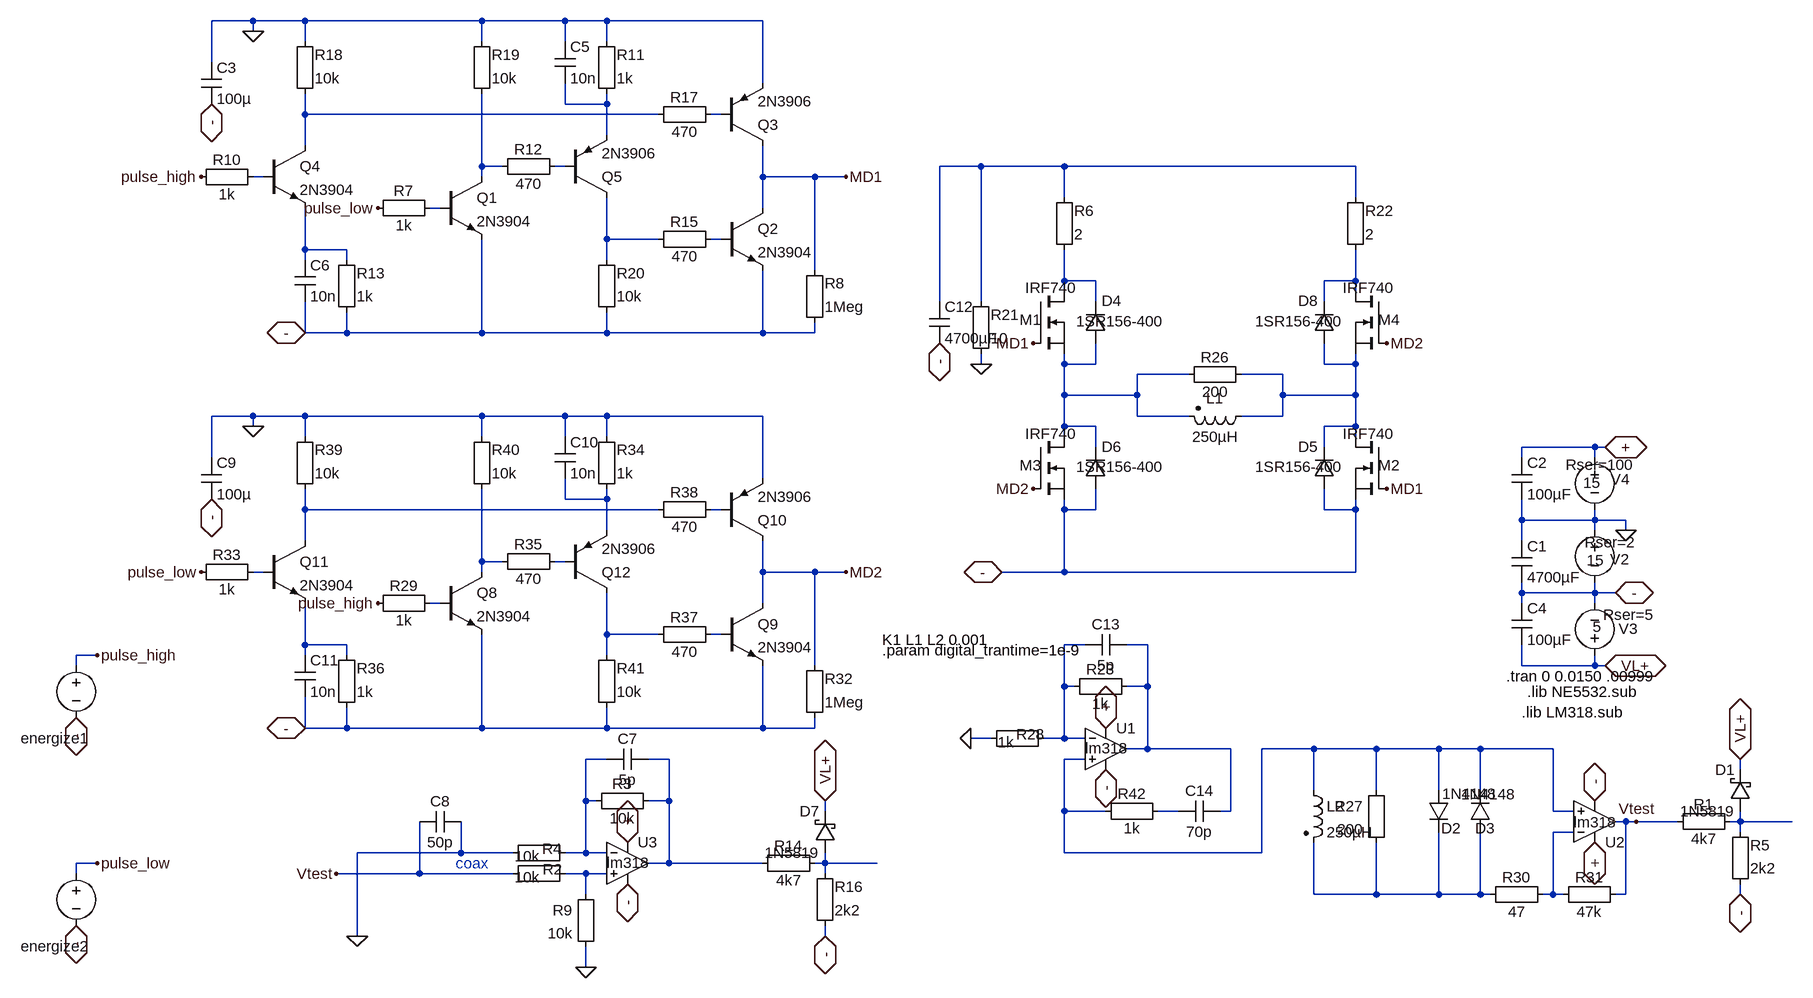
[diagram p0: schematic metal_low_power_fast_switch_ZVT_5.asc]
metal_low_power_fast_switch_ZVT_5.asc, the LTspice schematic file:
Version 4
SHEET 1 6068 1612
WIRE 96 -3040 32 -3040
WIRE 176 -3040 96 -3040
WIRE 448 -3040 176 -3040
WIRE 576 -3040 448 -3040
WIRE 640 -3040 576 -3040
WIRE 880 -3040 640 -3040
WIRE 96 -3024 96 -3040
WIRE 176 -3008 176 -3040
WIRE 448 -3008 448 -3040
WIRE 576 -3008 576 -3040
WIRE 640 -3008 640 -3040
WIRE 32 -2976 32 -3040
WIRE 880 -2944 880 -3040
WIRE 576 -2912 576 -2944
WIRE 640 -2912 640 -2928
WIRE 640 -2912 576 -2912
WIRE 176 -2896 176 -2928
WIRE 720 -2896 176 -2896
WIRE 816 -2896 800 -2896
WIRE 640 -2864 640 -2912
WIRE 176 -2848 176 -2896
WIRE 448 -2816 448 -2928
WIRE 480 -2816 448 -2816
WIRE 576 -2816 560 -2816
WIRE 1216 -2816 1152 -2816
WIRE 1344 -2816 1216 -2816
WIRE 1792 -2816 1344 -2816
WIRE 112 -2800 96 -2800
WIRE 448 -2800 448 -2816
WIRE 880 -2800 880 -2848
WIRE 960 -2800 880 -2800
WIRE 1008 -2800 960 -2800
WIRE 1344 -2768 1344 -2816
WIRE 1792 -2768 1792 -2816
WIRE 384 -2752 368 -2752
WIRE 880 -2752 880 -2800
WIRE 640 -2704 640 -2768
WIRE 720 -2704 640 -2704
WIRE 816 -2704 800 -2704
WIRE 176 -2688 176 -2752
WIRE 240 -2688 176 -2688
WIRE 176 -2672 176 -2688
WIRE 240 -2672 240 -2688
WIRE 640 -2672 640 -2704
WIRE 960 -2656 960 -2800
WIRE 1344 -2640 1344 -2688
WIRE 1392 -2640 1344 -2640
WIRE 1792 -2640 1792 -2688
WIRE 1792 -2640 1744 -2640
WIRE 1344 -2624 1344 -2640
WIRE 1792 -2624 1792 -2640
WIRE 1152 -2608 1152 -2816
WIRE 1216 -2608 1216 -2816
WIRE 1392 -2608 1392 -2640
WIRE 1744 -2608 1744 -2640
WIRE 176 -2560 176 -2608
WIRE 240 -2560 240 -2592
WIRE 240 -2560 176 -2560
WIRE 448 -2560 448 -2704
WIRE 448 -2560 240 -2560
WIRE 640 -2560 640 -2592
WIRE 640 -2560 448 -2560
WIRE 880 -2560 880 -2656
WIRE 880 -2560 640 -2560
WIRE 960 -2560 960 -2576
WIRE 960 -2560 880 -2560
WIRE 1216 -2512 1216 -2528
WIRE 1344 -2512 1344 -2528
WIRE 1392 -2512 1392 -2544
WIRE 1392 -2512 1344 -2512
WIRE 1744 -2512 1744 -2544
WIRE 1792 -2512 1792 -2528
WIRE 1792 -2512 1744 -2512
WIRE 1536 -2496 1456 -2496
WIRE 1680 -2496 1616 -2496
WIRE 1344 -2464 1344 -2512
WIRE 1456 -2464 1456 -2496
WIRE 1456 -2464 1344 -2464
WIRE 1680 -2464 1680 -2496
WIRE 1792 -2464 1792 -2512
WIRE 1792 -2464 1680 -2464
WIRE 96 -2432 32 -2432
WIRE 176 -2432 96 -2432
WIRE 448 -2432 176 -2432
WIRE 576 -2432 448 -2432
WIRE 640 -2432 576 -2432
WIRE 880 -2432 640 -2432
WIRE 1456 -2432 1456 -2464
WIRE 1536 -2432 1456 -2432
WIRE 1680 -2432 1680 -2464
WIRE 1680 -2432 1616 -2432
WIRE 96 -2416 96 -2432
WIRE 1344 -2416 1344 -2464
WIRE 1392 -2416 1344 -2416
WIRE 1792 -2416 1792 -2464
WIRE 1792 -2416 1744 -2416
WIRE 176 -2400 176 -2432
WIRE 448 -2400 448 -2432
WIRE 576 -2400 576 -2432
WIRE 640 -2400 640 -2432
WIRE 1344 -2400 1344 -2416
WIRE 1792 -2400 1792 -2416
WIRE 1392 -2384 1392 -2416
WIRE 1744 -2384 1744 -2416
WIRE 2160 -2384 2048 -2384
WIRE 2176 -2384 2160 -2384
WIRE 32 -2368 32 -2432
WIRE 2048 -2368 2048 -2384
WIRE 2160 -2368 2160 -2384
WIRE 880 -2336 880 -2432
WIRE 576 -2304 576 -2336
WIRE 640 -2304 640 -2320
WIRE 640 -2304 576 -2304
WIRE 176 -2288 176 -2320
WIRE 720 -2288 176 -2288
WIRE 816 -2288 800 -2288
WIRE 1344 -2288 1344 -2304
WIRE 1392 -2288 1392 -2320
WIRE 1392 -2288 1344 -2288
WIRE 1744 -2288 1744 -2320
WIRE 1792 -2288 1792 -2304
WIRE 1792 -2288 1744 -2288
WIRE 2048 -2272 2048 -2304
WIRE 2160 -2272 2160 -2288
WIRE 2160 -2272 2048 -2272
WIRE 2208 -2272 2160 -2272
WIRE 640 -2256 640 -2304
WIRE 2160 -2256 2160 -2272
WIRE 2208 -2256 2208 -2272
WIRE 176 -2240 176 -2288
WIRE 2048 -2240 2048 -2272
WIRE 448 -2208 448 -2320
WIRE 480 -2208 448 -2208
WIRE 576 -2208 560 -2208
WIRE 112 -2192 96 -2192
WIRE 448 -2192 448 -2208
WIRE 880 -2192 880 -2240
WIRE 960 -2192 880 -2192
WIRE 1008 -2192 960 -2192
WIRE 1344 -2192 1344 -2288
WIRE 1344 -2192 1248 -2192
WIRE 1792 -2192 1792 -2288
WIRE 1792 -2192 1344 -2192
WIRE 2048 -2160 2048 -2176
WIRE 2160 -2160 2160 -2176
WIRE 2160 -2160 2048 -2160
WIRE 2192 -2160 2160 -2160
WIRE 384 -2144 368 -2144
WIRE 880 -2144 880 -2192
WIRE 2048 -2144 2048 -2160
WIRE 2160 -2144 2160 -2160
WIRE 640 -2096 640 -2160
WIRE 720 -2096 640 -2096
WIRE 816 -2096 800 -2096
WIRE 176 -2080 176 -2144
WIRE 240 -2080 176 -2080
WIRE 1376 -2080 1344 -2080
WIRE 1472 -2080 1440 -2080
WIRE -144 -2064 -176 -2064
WIRE 176 -2064 176 -2080
WIRE 240 -2064 240 -2080
WIRE 640 -2064 640 -2096
WIRE -176 -2048 -176 -2064
WIRE 960 -2048 960 -2192
WIRE 2048 -2048 2048 -2080
WIRE 2160 -2048 2160 -2064
WIRE 2160 -2048 2048 -2048
WIRE 2176 -2048 2160 -2048
WIRE 1344 -2016 1344 -2080
WIRE 1360 -2016 1344 -2016
WIRE 1472 -2016 1472 -2080
WIRE 1472 -2016 1440 -2016
WIRE 176 -1952 176 -2000
WIRE 240 -1952 240 -1984
WIRE 240 -1952 176 -1952
WIRE 448 -1952 448 -2096
WIRE 448 -1952 240 -1952
WIRE 640 -1952 640 -1984
WIRE 640 -1952 448 -1952
WIRE 880 -1952 880 -2048
WIRE 880 -1952 640 -1952
WIRE 960 -1952 960 -1968
WIRE 960 -1952 880 -1952
WIRE 1232 -1936 1200 -1936
WIRE 1344 -1936 1344 -2016
WIRE 1344 -1936 1312 -1936
WIRE 1376 -1936 1344 -1936
WIRE 1472 -1920 1472 -2016
WIRE 1472 -1920 1440 -1920
WIRE 1600 -1920 1472 -1920
WIRE 1728 -1920 1648 -1920
WIRE 1824 -1920 1728 -1920
WIRE 1920 -1920 1824 -1920
WIRE 1984 -1920 1920 -1920
WIRE 2096 -1920 1984 -1920
WIRE 640 -1904 608 -1904
WIRE 736 -1904 704 -1904
WIRE 1376 -1904 1344 -1904
WIRE 2384 -1888 2384 -1904
WIRE 1728 -1856 1728 -1920
WIRE 1824 -1856 1824 -1920
WIRE 1920 -1856 1920 -1920
WIRE 1984 -1856 1984 -1920
WIRE 608 -1840 608 -1904
WIRE 624 -1840 608 -1840
WIRE 736 -1840 736 -1904
WIRE 736 -1840 704 -1840
WIRE 976 -1824 976 -1840
WIRE 1344 -1824 1344 -1904
WIRE 1408 -1824 1344 -1824
WIRE 1520 -1824 1488 -1824
WIRE 1600 -1824 1600 -1920
WIRE 1600 -1824 1584 -1824
WIRE 2096 -1824 2096 -1920
WIRE 2128 -1824 2096 -1824
WIRE 2208 -1808 2192 -1808
WIRE 2224 -1808 2208 -1808
WIRE 2288 -1808 2224 -1808
WIRE 2384 -1808 2384 -1824
WIRE 2384 -1808 2368 -1808
WIRE 2464 -1808 2384 -1808
WIRE 2128 -1792 2096 -1792
WIRE 2384 -1792 2384 -1808
WIRE 416 -1760 416 -1808
WIRE 416 -1760 256 -1760
WIRE 496 -1760 416 -1760
WIRE 608 -1760 608 -1840
WIRE 608 -1760 576 -1760
WIRE 640 -1760 608 -1760
WIRE 1344 -1760 1344 -1824
WIRE 1648 -1760 1648 -1920
WIRE 1648 -1760 1344 -1760
WIRE -144 -1744 -176 -1744
WIRE 736 -1744 736 -1840
WIRE 736 -1744 704 -1744
WIRE 880 -1744 736 -1744
WIRE 976 -1744 976 -1760
WIRE 976 -1744 960 -1744
WIRE 1056 -1744 976 -1744
WIRE -176 -1728 -176 -1744
WIRE 352 -1728 352 -1808
WIRE 352 -1728 224 -1728
WIRE 496 -1728 352 -1728
WIRE 608 -1728 576 -1728
WIRE 640 -1728 608 -1728
WIRE 976 -1728 976 -1744
WIRE 608 -1696 608 -1728
WIRE 1728 -1696 1728 -1776
WIRE 1824 -1696 1824 -1776
WIRE 1824 -1696 1728 -1696
WIRE 1920 -1696 1920 -1792
WIRE 1920 -1696 1824 -1696
WIRE 1984 -1696 1984 -1792
WIRE 1984 -1696 1920 -1696
WIRE 2000 -1696 1984 -1696
WIRE 2096 -1696 2096 -1792
WIRE 2096 -1696 2080 -1696
WIRE 2112 -1696 2096 -1696
WIRE 2208 -1696 2208 -1808
WIRE 2208 -1696 2192 -1696
WIRE 2384 -1696 2384 -1712
WIRE 256 -1632 256 -1760
WIRE 976 -1632 976 -1648
WIRE 608 -1584 608 -1616
FLAG 2192 -2160 -
IOPIN 2192 -2160 BiDir
FLAG 2176 -2384 +
IOPIN 2176 -2384 BiDir
FLAG 2208 -2256 0
FLAG 2176 -2048 VL+
IOPIN 2176 -2048 BiDir
FLAG 976 -1632 -
IOPIN 976 -1632 BiDir
FLAG 976 -1840 VL+
IOPIN 976 -1840 BiDir
FLAG 672 -1776 +
IOPIN 672 -1776 BiDir
FLAG 672 -1712 -
IOPIN 672 -1712 BiDir
FLAG 224 -1728 Vtest
FLAG 608 -1584 0
FLAG 256 -1632 0
FLAG 32 -2304 -
IOPIN 32 -2304 BiDir
FLAG 96 -2416 0
FLAG 2160 -1776 +
IOPIN 2160 -1776 BiDir
FLAG 2160 -1840 -
IOPIN 2160 -1840 BiDir
FLAG 2224 -1808 Vtest
FLAG 2384 -1696 -
IOPIN 2384 -1696 BiDir
FLAG 2384 -1904 VL+
IOPIN 2384 -1904 BiDir
FLAG -176 -1968 -
IOPIN -176 -1968 BiDir
FLAG -144 -2064 pulse_high
FLAG -176 -1648 -
IOPIN -176 -1648 BiDir
FLAG -144 -1744 pulse_low
FLAG 32 -2912 -
IOPIN 32 -2912 BiDir
FLAG 96 -3024 0
FLAG 1008 -2800 MD1
FLAG 1008 -2192 MD2
FLAG 1296 -2320 MD2
FLAG 1840 -2544 MD2
FLAG 1296 -2544 MD1
FLAG 1840 -2320 MD1
FLAG 1152 -2544 -
IOPIN 1152 -2544 BiDir
FLAG 1216 -2512 0
FLAG 1248 -2192 -
IOPIN 1248 -2192 BiDir
FLAG 176 -2560 -
IOPIN 176 -2560 BiDir
FLAG 176 -1952 -
IOPIN 176 -1952 BiDir
FLAG 288 -2144 pulse_high
FLAG 16 -2800 pulse_high
FLAG 16 -2192 pulse_low
FLAG 288 -2752 pulse_low
FLAG 1408 -1952 +
IOPIN 1408 -1952 BiDir
FLAG 1408 -1888 -
IOPIN 1408 -1888 BiDir
FLAG 1200 -1936 0
SYMBOL voltage 2160 -2272 M0
WINDOW 123 0 0 Left 2
WINDOW 39 -63 34 Left 2
WINDOW 0 -53 60 Left 2
WINDOW 3 -15 62 Left 2
SYMATTR SpiceLine Rser=2
SYMATTR InstName V2
SYMATTR Value 15
SYMBOL voltage 2160 -2384 M0
WINDOW 123 0 0 Left 2
WINDOW 39 -61 27 Left 2
WINDOW 0 -54 49 Left 2
WINDOW 3 -9 55 Left 2
SYMATTR SpiceLine Rser=100
SYMATTR InstName V4
SYMATTR Value 15
SYMBOL voltage 2160 -2048 M180
WINDOW 123 0 0 Left 2
WINDOW 39 13 78 Left 2
WINDOW 0 37 57 Left 2
WINDOW 3 -3 60 Left 2
SYMATTR SpiceLine Rser=5
SYMATTR InstName V3
SYMATTR Value 5
SYMBOL Misc\\EuropeanCap 2032 -2240 R0
SYMATTR InstName C1
SYMATTR Value 4700µF
SYMATTR SpiceLine V=400 Irms=1 Rser=.32 Lser=0
SYMBOL Misc\\EuropeanCap 2032 -2368 R0
SYMATTR InstName C2
SYMATTR Value 100µF
SYMATTR SpiceLine V=400 Irms=1 Rser=.32 Lser=0
SYMBOL Misc\\EuropeanCap 2032 -2144 R0
SYMATTR InstName C4
SYMATTR Value 100µF
SYMATTR SpiceLine V=400 Irms=1 Rser=.32 Lser=0
SYMBOL Misc\\EuropeanResistor 864 -1728 R270
WINDOW 0 27 56 VTop 2
WINDOW 3 5 56 VBottom 2
SYMATTR InstName R14
SYMATTR Value 4k7
SYMBOL Misc\\EuropeanResistor 960 -1632 M180
WINDOW 0 31 76 Left 2
WINDOW 3 31 40 Left 2
SYMATTR InstName R16
SYMATTR Value 2k2
SYMBOL schottky 992 -1760 R180
WINDOW 0 24 64 Left 2
WINDOW 3 24 0 Left 2
SYMATTR InstName D7
SYMATTR Value 1N5819
SYMATTR Description Diode
SYMATTR Type diode
SYMBOL Opamps\\opamp2 672 -1808 R0
WINDOW 3 -32 63 Left 2
SYMATTR Value lm318
SYMATTR InstName U3
SYMBOL Misc\\EuropeanResistor 608 -1856 M90
WINDOW 0 5 56 VBottom 2
WINDOW 3 27 56 VTop 2
SYMATTR InstName R3
SYMATTR Value 10k
SYMBOL Misc\\EuropeanCap 704 -1888 M270
WINDOW 0 32 32 VTop 2
WINDOW 3 0 32 VBottom 2
SYMATTR InstName C7
SYMATTR Value 5p
SYMATTR SpiceLine V=400 Irms=1 Rser=.32 Lser=0
SYMBOL Misc\\EuropeanCap 416 -1792 M270
WINDOW 0 32 32 VTop 2
WINDOW 3 0 32 VBottom 2
SYMATTR InstName C8
SYMATTR Value 50p
SYMATTR SpiceLine V=400 Irms=1 Rser=.32 Lser=0
SYMBOL Misc\\EuropeanResistor 480 -1744 M90
WINDOW 0 25 77 VBottom 2
WINDOW 3 6 38 VTop 2
SYMATTR InstName R2
SYMATTR Value 10k
SYMBOL Misc\\EuropeanResistor 624 -1712 M0
SYMATTR InstName R9
SYMATTR Value 10k
SYMBOL Misc\\EuropeanResistor 480 -1776 M90
WINDOW 0 25 76 VBottom 2
WINDOW 3 6 38 VTop 2
SYMATTR InstName R4
SYMATTR Value 10k
SYMBOL Misc\\EuropeanCap 16 -2368 R0
SYMATTR InstName C9
SYMATTR Value 100µ
SYMATTR SpiceLine V=400 Irms=1 Rser=.32 Lser=0
SYMBOL Misc\\EuropeanResistor 1520 -2512 M90
WINDOW 0 5 56 VBottom 2
WINDOW 3 27 56 VTop 2
SYMATTR InstName R26
SYMATTR Value 200
SYMBOL Misc\\EuropeanResistor 1840 -1872 M0
SYMATTR InstName R27
SYMATTR Value 200
SYMBOL diode 1904 -1856 R0
WINDOW 3 21 5 Left 2
WINDOW 0 20 58 Left 2
SYMATTR Value 1N4148
SYMATTR InstName D2
SYMBOL diode 2000 -1792 R180
WINDOW 0 -7 6 Left 2
WINDOW 3 -39 58 Left 2
SYMATTR InstName D3
SYMATTR Value 1N4148
SYMBOL nmos 1296 -2400 R0
WINDOW 0 -21 44 Left 2
WINDOW 3 -12 -5 Left 2
SYMATTR InstName M3
SYMATTR Value IRF740
SYMBOL npn3 384 -2192 R0
SYMATTR InstName Q8
SYMATTR Value 2N3904
SYMBOL Misc\\EuropeanResistor 272 -2160 M90
WINDOW 0 5 56 VBottom 2
WINDOW 3 27 56 VTop 2
SYMATTR InstName R29
SYMATTR Value 1k
SYMBOL Opamps\\opamp2 2160 -1744 M180
WINDOW 3 -32 63 Left 2
SYMATTR Value lm318
SYMATTR InstName U2
SYMBOL Misc\\EuropeanResistor 1984 -1680 R270
WINDOW 0 27 56 VTop 2
WINDOW 3 5 56 VBottom 2
SYMATTR InstName R30
SYMATTR Value 47
SYMBOL Misc\\EuropeanResistor 2096 -1680 R270
WINDOW 0 27 56 VTop 2
WINDOW 3 5 56 VBottom 2
SYMATTR InstName R31
SYMATTR Value 47k
SYMBOL npn3 816 -2144 R0
SYMATTR InstName Q9
SYMATTR Value 2N3904
SYMBOL diode 1408 -2320 R180
WINDOW 0 -24 65 Left 2
WINDOW 3 -90 34 Left 2
SYMATTR InstName D6
SYMATTR Value 1SR156-400
SYMATTR Description Zener Diode
SYMATTR Type zener
SYMBOL pnp2 816 -2240 M180
SYMATTR InstName Q10
SYMATTR Value 2N3906
SYMBOL Misc\\EuropeanResistor 944 -1952 M180
WINDOW 0 31 76 Left 2
WINDOW 3 31 40 Left 2
SYMATTR InstName R32
SYMATTR Value 1Meg
SYMBOL voltage -176 -2064 M0
WINDOW 0 -21 128 Left 2
WINDOW 3 -134 119 Invisible 2
WINDOW 123 0 0 Left 2
SYMATTR InstName energize1
SYMATTR Value PULSE(0 4.8 .01 {digital_trantime} {digital_trantime} .002 .004 1000)
SYMATTR SpiceLine Rser=0
SYMBOL npn3 112 -2240 R0
SYMATTR InstName Q11
SYMATTR Value 2N3904
SYMBOL Misc\\EuropeanResistor 0 -2208 M90
WINDOW 0 5 56 VBottom 2
WINDOW 3 27 56 VTop 2
SYMATTR InstName R33
SYMATTR Value 1k
SYMBOL pnp2 576 -2160 M180
SYMATTR InstName Q12
SYMATTR Value 2N3906
SYMBOL Misc\\EuropeanResistor 624 -2304 M180
WINDOW 0 31 76 Left 2
WINDOW 3 31 40 Left 2
SYMATTR InstName R34
SYMATTR Value 1k
SYMBOL Misc\\EuropeanResistor 464 -2224 M90
WINDOW 0 5 56 VBottom 2
WINDOW 3 27 56 VTop 2
SYMATTR InstName R35
SYMATTR Value 470
SYMBOL Misc\\EuropeanCap 560 -2400 R0
SYMATTR InstName C10
SYMATTR Value 10n
SYMATTR SpiceLine V=400 Irms=1 Rser=.32 Lser=0
SYMBOL Misc\\EuropeanResistor 224 -1968 M180
WINDOW 0 31 76 Left 2
WINDOW 3 31 40 Left 2
SYMATTR InstName R36
SYMATTR Value 1k
SYMBOL Misc\\EuropeanCap 160 -2064 R0
SYMATTR InstName C11
SYMATTR Value 10n
SYMATTR SpiceLine V=400 Irms=1 Rser=.32 Lser=0
SYMBOL Misc\\EuropeanResistor 816 -2080 M270
WINDOW 0 27 56 VTop 2
WINDOW 3 5 56 VBottom 2
SYMATTR InstName R37
SYMATTR Value 470
SYMBOL Misc\\EuropeanResistor 704 -2304 M90
WINDOW 0 5 56 VBottom 2
WINDOW 3 27 56 VTop 2
SYMATTR InstName R38
SYMATTR Value 470
SYMBOL Misc\\EuropeanResistor 160 -2304 M180
WINDOW 0 31 76 Left 2
WINDOW 3 31 40 Left 2
SYMATTR InstName R39
SYMATTR Value 10k
SYMBOL Misc\\EuropeanResistor 432 -2304 M180
WINDOW 0 31 76 Left 2
WINDOW 3 31 40 Left 2
SYMATTR InstName R40
SYMATTR Value 10k
SYMBOL Misc\\EuropeanResistor 624 -1968 M180
WINDOW 0 31 76 Left 2
WINDOW 3 31 40 Left 2
SYMATTR InstName R41
SYMATTR Value 10k
SYMBOL ind2 1632 -2448 R90
WINDOW 0 4 56 VBottom 2
WINDOW 3 32 56 VTop 2
SYMATTR InstName L1
SYMATTR Value 250µH
SYMATTR SpiceLine Rser=.4 Cpar=20p
SYMATTR Type ind
SYMBOL Misc\\EuropeanResistor 2272 -1792 R270
WINDOW 0 27 56 VTop 2
WINDOW 3 5 56 VBottom 2
SYMATTR InstName R1
SYMATTR Value 4k7
SYMBOL Misc\\EuropeanResistor 2368 -1696 M180
WINDOW 0 31 76 Left 2
WINDOW 3 31 40 Left 2
SYMATTR InstName R5
SYMATTR Value 2k2
SYMBOL schottky 2400 -1824 R180
WINDOW 0 24 64 Left 2
WINDOW 3 24 0 Left 2
SYMATTR InstName D1
SYMATTR Value 1N5819
SYMATTR Description Diode
SYMATTR Type diode
SYMBOL ind2 1712 -1872 R0
SYMATTR InstName L2
SYMATTR Value 250µH
SYMATTR SpiceLine Rser=.4 Cpar=70p
SYMATTR Type ind
SYMBOL nmos 1296 -2624 R0
WINDOW 0 -21 44 Left 2
WINDOW 3 -12 -5 Left 2
SYMATTR InstName M1
SYMATTR Value IRF740
SYMBOL diode 1408 -2544 R180
WINDOW 0 -24 65 Left 2
WINDOW 3 -90 34 Left 2
SYMATTR InstName D4
SYMATTR Value 1SR156-400
SYMATTR Description Zener Diode
SYMATTR Type zener
SYMBOL Misc\\EuropeanCap 16 -2976 R0
SYMATTR InstName C3
SYMATTR Value 100µ
SYMATTR SpiceLine V=400 Irms=1 Rser=.32 Lser=0
SYMBOL nmos 1840 -2400 M0
WINDOW 0 -21 44 Left 2
WINDOW 3 -12 -5 Left 2
SYMATTR InstName M2
SYMATTR Value IRF740
SYMBOL npn3 384 -2800 R0
SYMATTR InstName Q1
SYMATTR Value 2N3904
SYMBOL Misc\\EuropeanResistor 272 -2768 M90
WINDOW 0 5 56 VBottom 2
WINDOW 3 27 56 VTop 2
SYMATTR InstName R7
SYMATTR Value 1k
SYMBOL npn3 816 -2752 R0
SYMATTR InstName Q2
SYMATTR Value 2N3904
SYMBOL diode 1728 -2320 M180
WINDOW 0 -24 65 Left 2
WINDOW 3 -90 34 Left 2
SYMATTR InstName D5
SYMATTR Value 1SR156-400
SYMATTR Description Zener Diode
SYMATTR Type zener
SYMBOL pnp2 816 -2848 M180
SYMATTR InstName Q3
SYMATTR Value 2N3906
SYMBOL Misc\\EuropeanResistor 944 -2560 M180
WINDOW 0 31 76 Left 2
WINDOW 3 31 40 Left 2
SYMATTR InstName R8
SYMATTR Value 1Meg
SYMBOL npn3 112 -2848 R0
SYMATTR InstName Q4
SYMATTR Value 2N3904
SYMBOL Misc\\EuropeanResistor 0 -2816 M90
WINDOW 0 5 56 VBottom 2
WINDOW 3 27 56 VTop 2
SYMATTR InstName R10
SYMATTR Value 1k
SYMBOL pnp2 576 -2768 M180
SYMATTR InstName Q5
SYMATTR Value 2N3906
SYMBOL Misc\\EuropeanResistor 624 -2912 M180
WINDOW 0 31 76 Left 2
WINDOW 3 31 40 Left 2
SYMATTR InstName R11
SYMATTR Value 1k
SYMBOL Misc\\EuropeanResistor 464 -2832 M90
WINDOW 0 5 56 VBottom 2
WINDOW 3 27 56 VTop 2
SYMATTR InstName R12
SYMATTR Value 470
SYMBOL Misc\\EuropeanCap 560 -3008 R0
SYMATTR InstName C5
SYMATTR Value 10n
SYMATTR SpiceLine V=400 Irms=1 Rser=.32 Lser=0
SYMBOL Misc\\EuropeanResistor 224 -2576 M180
WINDOW 0 31 76 Left 2
WINDOW 3 31 40 Left 2
SYMATTR InstName R13
SYMATTR Value 1k
SYMBOL Misc\\EuropeanCap 160 -2672 R0
SYMATTR InstName C6
SYMATTR Value 10n
SYMATTR SpiceLine V=400 Irms=1 Rser=.32 Lser=0
SYMBOL Misc\\EuropeanResistor 816 -2688 M270
WINDOW 0 27 56 VTop 2
WINDOW 3 5 56 VBottom 2
SYMATTR InstName R15
SYMATTR Value 470
SYMBOL Misc\\EuropeanResistor 704 -2912 M90
WINDOW 0 5 56 VBottom 2
WINDOW 3 27 56 VTop 2
SYMATTR InstName R17
SYMATTR Value 470
SYMBOL Misc\\EuropeanResistor 160 -2912 M180
WINDOW 0 31 76 Left 2
WINDOW 3 31 40 Left 2
SYMATTR InstName R18
SYMATTR Value 10k
SYMBOL Misc\\EuropeanResistor 432 -2912 M180
WINDOW 0 31 76 Left 2
WINDOW 3 31 40 Left 2
SYMATTR InstName R19
SYMATTR Value 10k
SYMBOL Misc\\EuropeanResistor 624 -2576 M180
WINDOW 0 31 76 Left 2
WINDOW 3 31 40 Left 2
SYMATTR InstName R20
SYMATTR Value 10k
SYMBOL nmos 1840 -2624 M0
WINDOW 0 -21 44 Left 2
WINDOW 3 -12 -5 Left 2
SYMATTR InstName M4
SYMATTR Value IRF740
SYMBOL diode 1728 -2544 M180
WINDOW 0 -24 65 Left 2
WINDOW 3 -90 34 Left 2
SYMATTR InstName D8
SYMATTR Value 1SR156-400
SYMATTR Description Zener Diode
SYMATTR Type zener
SYMBOL Misc\\EuropeanCap 1136 -2608 R0
SYMATTR InstName C12
SYMATTR Value 4700µF
SYMATTR SpiceLine V=400 Irms=1 Rser=.32 Lser=0
SYMBOL Misc\\EuropeanResistor 1200 -2512 M180
WINDOW 0 31 76 Left 2
WINDOW 3 31 40 Left 2
SYMATTR InstName R21
SYMATTR Value 10
SYMBOL voltage -176 -1744 M0
WINDOW 0 -21 128 Left 2
WINDOW 3 -134 119 Invisible 2
WINDOW 123 0 0 Left 2
SYMATTR InstName energize2
SYMATTR Value PULSE(0 4.8 .012 {digital_trantime} {digital_trantime} .002 .004 1000)
SYMATTR SpiceLine Rser=0
SYMBOL Misc\\EuropeanResistor 1328 -2672 M180
WINDOW 0 31 76 Left 2
WINDOW 3 31 40 Left 2
SYMATTR InstName R6
SYMATTR Value 2
SYMBOL Misc\\EuropeanResistor 1776 -2672 M180
WINDOW 0 31 76 Left 2
WINDOW 3 31 40 Left 2
SYMATTR InstName R22
SYMATTR Value 2
SYMBOL Opamps\\opamp2 1408 -1984 R0
WINDOW 3 -32 63 Left 2
SYMATTR Value lm318
SYMATTR InstName U1
SYMBOL Misc\\EuropeanResistor 1344 -2032 M90
WINDOW 0 5 56 VBottom 2
WINDOW 3 27 56 VTop 2
SYMATTR InstName R23
SYMATTR Value 1k
SYMBOL Misc\\EuropeanCap 1440 -2064 M270
WINDOW 0 32 32 VTop 2
WINDOW 3 0 32 VBottom 2
SYMATTR InstName C13
SYMATTR Value 5p
SYMATTR SpiceLine V=400 Irms=1 Rser=.32 Lser=0
SYMBOL Misc\\EuropeanResistor 1216 -1952 M90
WINDOW 0 25 76 VBottom 2
WINDOW 3 6 38 VTop 2
SYMATTR InstName R28
SYMATTR Value 1k
SYMBOL Misc\\EuropeanCap 1584 -1808 M270
WINDOW 0 32 32 VTop 2
WINDOW 3 0 32 VBottom 2
SYMATTR InstName C14
SYMATTR Value 70p
SYMATTR SpiceLine V=400 Irms=1 Rser=.32 Lser=0
SYMBOL Misc\\EuropeanResistor 1392 -1840 M90
WINDOW 0 5 56 VBottom 2
WINDOW 3 27 56 VTop 2
SYMATTR InstName R42
SYMATTR Value 1k
TEXT 2024 -2032 Left 2 !.tran 0 0.0150 .00999
TEXT 2056 -2008 Left 2 !.lib NE5532.sub
TEXT 2048 -1976 Left 2 !.lib LM318.sub
TEXT 408 -1744 Left 2 ;coax
TEXT 1064 -2072 Left 2 !.param digital_trantime=1e-9
TEXT 1064 -2088 Left 2 !K1 L1 L2 0.001

The netlist it stands for:
* metal_low_power_fast_switch_ZVT_5.asc
V2 0 - 15 Rser=2
V4 + 0 15 Rser=100
V3 VL+ - 5 Rser=5
C1 0 - 4700µF V=400 Irms=1 Rser=.32 Lser=0
C2 + 0 100µF V=400 Irms=1 Rser=.32 Lser=0
C4 - VL+ 100µF V=400 Irms=1 Rser=.32 Lser=0
R14 N030 N034 4k7
R16 - N034 2k2
D7 N034 VL+ 1N5819
XU3 N035 N029 + - N030 lm318  ; pins In+ In- V+ V- OUT
R3 N029 N030 10k
C7 N030 N029 5p V=400 Irms=1 Rser=.32 Lser=0
C8 0 Vtest 50p V=400 Irms=1 Rser=.32 Lser=0
R2 Vtest N035 10k
R9 N035 0 10k
R4 0 N029 10k
C9 0 - 100µ V=400 Irms=1 Rser=.32 Lser=0
R26 N014 N015 200
R27 N028 N036 200
D2 N028 N036 1N4148
D3 N036 N028 1N4148
M3 N014 MD2 - - IRF740
Q8 N019 N022 - 0 2N3904
R29 pulse_high N022 1k
XU2 N028 N033 + - Vtest lm318  ; pins In+ In- V+ V- OUT
R30 N036 N033 47
R31 N033 Vtest 47k
Q9 MD2 N024 - 0 2N3904
D6 - N014 1SR156-400
Q10 MD2 N018 0 0 2N3906
R32 - MD2 1Meg
V§energize1 pulse_high - PULSE(0 4.8 .01 {digital_trantime} {digital_trantime} .002 .004 1000) Rser=0
Q11 N017 N021 N025 0 2N3904
R33 pulse_low N021 1k
Q12 N023 N020 N016 0 2N3906
R34 N016 0 1k
R35 N019 N020 470
C10 0 N016 10n V=400 Irms=1 Rser=.32 Lser=0
R36 - N025 1k
C11 N025 - 10n V=400 Irms=1 Rser=.32 Lser=0
R37 N024 N023 470
R38 N017 N018 470
R39 N017 0 10k
R40 N019 0 10k
R41 - N023 10k
L1 N015 N014 250µH Rser=.4 Cpar=20p
R1 Vtest N032 4k7
R5 - N032 2k2
D1 N032 VL+ 1N5819
L2 N028 N036 250µH Rser=.4 Cpar=70p
M1 N012 MD1 N014 N014 IRF740
D4 N014 N012 1SR156-400
C3 0 - 100µ V=400 Irms=1 Rser=.32 Lser=0
M2 N015 MD1 - - IRF740
Q1 N004 N008 - 0 2N3904
R7 pulse_low N008 1k
Q2 MD1 N010 - 0 2N3904
D5 - N015 1SR156-400
Q3 MD1 N003 0 0 2N3906
R8 - MD1 1Meg
Q4 N002 N007 N011 0 2N3904
R10 pulse_high N007 1k
Q5 N009 N005 N001 0 2N3906
R11 N001 0 1k
R12 N004 N005 470
C5 0 N001 10n V=400 Irms=1 Rser=.32 Lser=0
R13 - N011 1k
C6 N011 - 10n V=400 Irms=1 Rser=.32 Lser=0
R15 N010 N009 470
R17 N002 N003 470
R18 N002 0 10k
R19 N004 0 10k
R20 - N009 10k
M4 N013 MD2 N015 N015 IRF740
D8 N015 N013 1SR156-400
C12 N006 - 4700µF V=400 Irms=1 Rser=.32 Lser=0
R21 0 N006 10
V§energize2 pulse_low - PULSE(0 4.8 .012 {digital_trantime} {digital_trantime} .002 .004 1000) Rser=0
R6 N012 N006 2
R22 N013 N006 2
XU1 N028 N026 + - N027 lm318  ; pins In+ In- V+ V- OUT
R23 N026 N027 1k
C13 N027 N026 5p V=400 Irms=1 Rser=.32 Lser=0
R28 0 N026 1k
C14 N027 N031 70p V=400 Irms=1 Rser=.32 Lser=0
R42 N028 N031 1k
.model D D
.lib standard.dio
.model NPN NPN
.model PNP PNP
.lib standard.bjt
.model NMOS NMOS
.model PMOS PMOS
.lib standard.mos
.tran 0 0.0150 .00999
.lib NE5532.sub
.lib LM318.sub
* coax
.param digital_trantime=1e-9
K1 L1 L2 0.001
.backanno
.end